# Altium project PTZ_CTRLER.PrjPcb
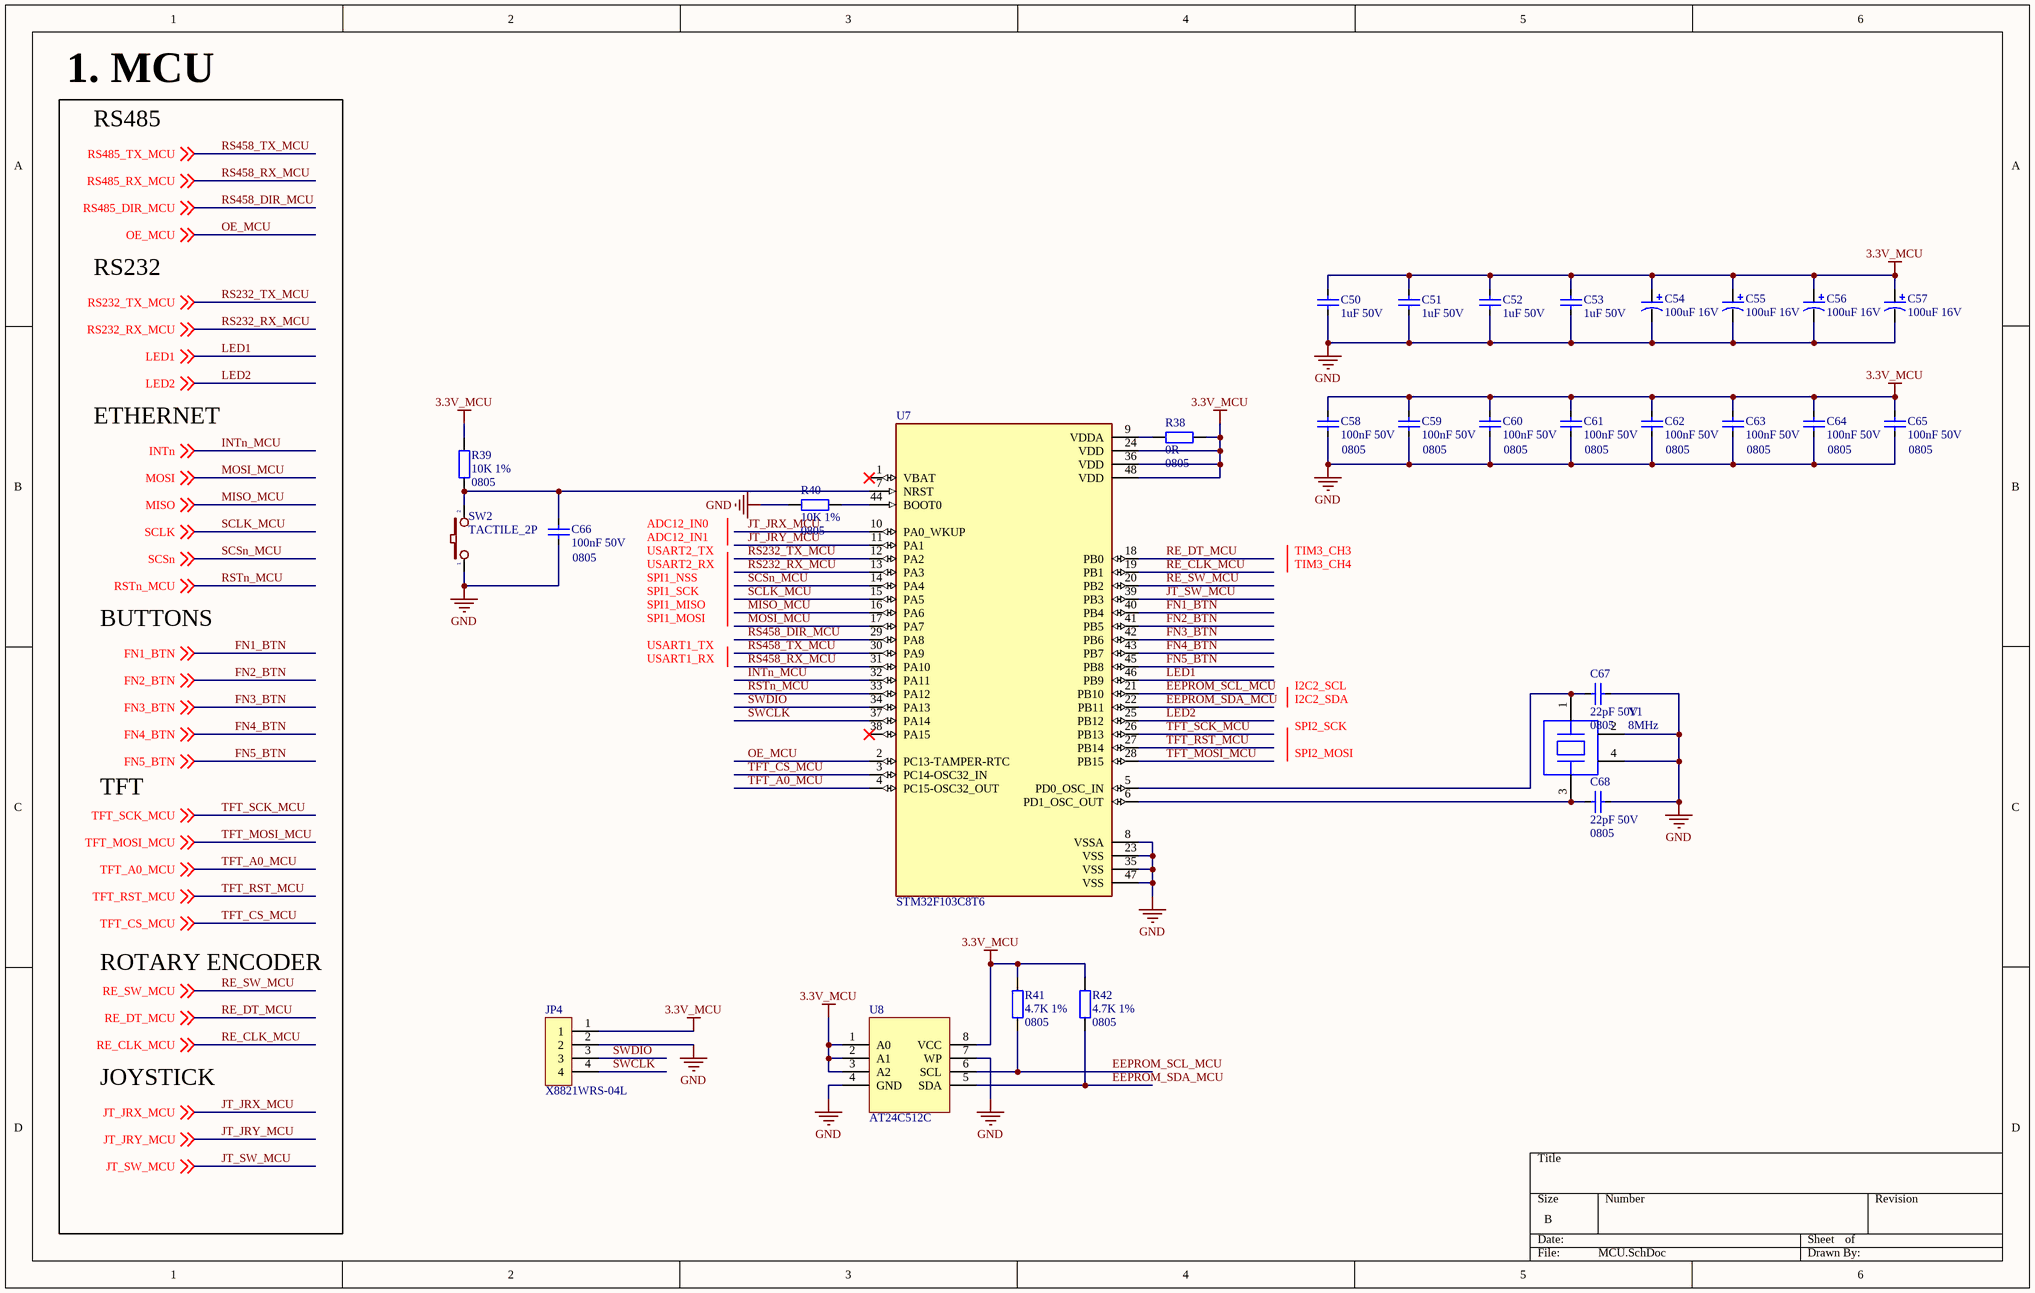
[diagram p0: MCU.SchDoc]
5 sheets, 138 parts. Net scope: global (net labels, ports and power ports of the same name join across sheets).
Sheets:
  MCU.SchDoc
  RS485_RS232.SchDoc
  ETHERNET.SchDoc
  SOURCE.SchDoc
  PERIPHERALS.SchDoc

## Sheet MCU.SchDoc
size B; SheetNumber: 1; SheetTotal: 5

### Parts
C50  1uF 50V  [CAP_SMD_0805]
C51  1uF 50V  [CAP_SMD_0805]
C52  1uF 50V  [CAP_SMD_0805]
C53  1uF 50V  [CAP_SMD_0805]
C54  100uF 16V  [CAP-ALU-SMD-D]
C55  100uF 16V  [CAP-ALU-SMD-D]
C56  100uF 16V  [CAP-ALU-SMD-D]
C57  100uF 16V  [CAP-ALU-SMD-D]
C58  100nF 50V  Size: 0805  [CAP_SMD_0805]
C59  100nF 50V  Size: 0805  [CAP_SMD_0805]
C60  100nF 50V  Size: 0805  [CAP_SMD_0805]
C61  100nF 50V  Size: 0805  [CAP_SMD_0805]
C62  100nF 50V  Size: 0805  [CAP_SMD_0805]
C63  100nF 50V  Size: 0805  [CAP_SMD_0805]
C64  100nF 50V  Size: 0805  [CAP_SMD_0805]
C65  100nF 50V  Size: 0805  [CAP_SMD_0805]
C66  100nF 50V  Size: 0805  [CAP_SMD_0805]
C67  22pF 50V  Size: 0805  [CAP_SMD_0805]
C68  22pF 50V  Size: 0805  [CAP_SMD_0805]
JP4  X8821WRS-04L  [CONN_X8821WRS-04L-LPSN]
R38  0R  Size: 0805  [RES_SMD_0805]
R39  10K 1%  Size: 0805  [RES_SMD_0805]
R40  10K 1%  Size: 0805  [RES_SMD_0805]
R41  4.7K 1%  Size: 0805  [RES_SMD_0805]
R42  4.7K 1%  Size: 0805  [RES_SMD_0805]
SW2  TACTILE_2P  [C&K BUTTON 2P]
U7  STM32F103C8T6  [LQFP-48]
U8  AT24C512C  [SOIC-8]
Y1  8MHz  [SMD-3225_4P]

### Nets
3.3V_MCU: C50.2 C51.2 C52.2 C53.2 C54.1 C55.1 C56.1 C57.1 C58.2 C59.2 C60.2 C61.2 C62.2 C63.2 C64.2 C65.2 JP4.1 R38.2 R39.2 R41.2 R42.2 U7.24(VDD) U7.36(VDD) U7.48(VDD) U8.1(A0) U8.2(A1) U8.3(A2) U8.8(VCC)
GND: C50.1 C51.1 C52.1 C53.1 C54.2 C55.2 C56.2 C57.2 C58.1 C59.1 C60.1 C61.1 C62.1 C63.1 C64.1 C65.1 C66.1 C67.1 C68.1 JP4.2 R40.1 SW2.1 U7.8(VSSA) U7.23(VSS) U7.35(VSS) U7.47(VSS) U8.4(GND) U8.7(WP) Y1.2 Y1.4
EEPROM_SCL_MCU: R41.1 U7.21(PB10) U8.6(SCL)
EEPROM_SDA_MCU: R42.1 U7.22(PB11) U8.5(SDA)
FN1_BTN: U7.40(PB4) ; off-sheet FN1_BTN
FN2_BTN: U7.41(PB5) ; off-sheet FN2_BTN
FN3_BTN: U7.42(PB6) ; off-sheet FN3_BTN
FN4_BTN: U7.43(PB7) ; off-sheet FN4_BTN
FN5_BTN: U7.45(PB8) ; off-sheet FN5_BTN
INTn_MCU: U7.32(PA11) ; off-sheet INTn  [also labelled INTn]
JT_JRX_MCU: U7.10(PA0_WKUP) ; off-sheet JT_JRX_MCU
JT_JRY_MCU: U7.11(PA1) ; off-sheet JT_JRY_MCU
JT_SW_MCU: U7.39(PB3) ; off-sheet JT_SW_MCU
LED1: U7.46(PB9) ; off-sheet LED1
LED2: U7.25(PB12) ; off-sheet LED2
MISO_MCU: U7.16(PA6) ; off-sheet MISO  [also labelled MISO]
MOSI_MCU: U7.17(PA7) ; off-sheet MOSI  [also labelled MOSI]
OE_MCU: U7.2(PC13-TAMPER-RTC) ; off-sheet OE_MCU
RE_CLK_MCU: U7.19(PB1) ; off-sheet RE_CLK_MCU
RE_DT_MCU: U7.18(PB0) ; off-sheet RE_DT_MCU
RE_SW_MCU: U7.20(PB2) ; off-sheet RE_SW_MCU
RS232_RX_MCU: U7.13(PA3) ; off-sheet RS232_RX_MCU
RS232_TX_MCU: U7.12(PA2) ; off-sheet RS232_TX_MCU
RS458_DIR_MCU: U7.29(PA8) ; off-sheet RS485_DIR_MCU  [also labelled RS485_DIR_MCU]
RS458_RX_MCU: U7.31(PA10) ; off-sheet RS485_RX_MCU  [also labelled RS485_RX_MCU]
RS458_TX_MCU: U7.30(PA9) ; off-sheet RS485_TX_MCU  [also labelled RS485_TX_MCU]
RSTn_MCU: U7.33(PA12) ; off-sheet RSTn_MCU
SCLK_MCU: U7.15(PA5) ; off-sheet SCLK  [also labelled SCLK]
SCSn_MCU: U7.14(PA4) ; off-sheet SCSn  [also labelled SCSn]
SWCLK: JP4.4 U7.37(PA14)
SWDIO: JP4.3 U7.34(PA13)
TFT_A0_MCU: U7.4(PC15-OSC32_OUT) ; off-sheet TFT_A0_MCU
TFT_CS_MCU: U7.3(PC14-OSC32_IN) ; off-sheet TFT_CS_MCU
TFT_MOSI_MCU: U7.28(PB15) ; off-sheet TFT_MOSI_MCU
TFT_RST_MCU: U7.27(PB14) ; off-sheet TFT_RST_MCU
TFT_SCK_MCU: U7.26(PB13) ; off-sheet TFT_SCK_MCU
NetC66_2: C66.2 R39.1 SW2.2 U7.7(NRST)
NetC67_2: C67.2 U7.5(PD0_OSC_IN) Y1.1
NetC68_2: C68.2 U7.6(PD1_OSC_OUT) Y1.3
NetR38_1: R38.1 U7.9(VDDA)
NetR40_2: R40.2 U7.44(BOOT0)

Not connected (* = marked no-connect by the designer): U7 1(VBAT)* 38(PA15)*

### Notes on the sheet
- 1. MCU
- RS485
- RS232
- ETHERNET
- USART2_TX
- USART2_RX
- ADC12_IN0
- ADC12_IN1
- TIM3_CH3
- TIM3_CH4
- BUTTONS
- SPI1_NSS
- SPI1_SCK
- SPI1_MISO
- SPI1_MOSI
- USART1_TX
- USART1_RX
- I2C2_SCL
- I2C2_SDA
- SPI2_SCK
- SPI2_MOSI
- TFT
- ROTARY ENCODER
- JOYSTICK

### Library data of the parts
C50-C53 = C0805_MLCC_1uF_50V: 1 µF ±10% 50V Ceramic Capacitor X7R 0805 (2012 Metric); Manufacturer: Samsung Electro-Mechanics; Manufacture Part Number: CL21B105KBFNNNG; Packaging: Cut Tape (CT); Link: https://www.digikey.cn/en/products/detail/samsung-electro-mechanics/CL21B105KBFNNNG/3894467; Price: $0.11; Size: 0805
C54-C57 = C_ALU_100uF_16V: 100uF 16V 63mA@120Hz ±20% SMD,D6.3xL5.4mm Aluminum Electrolytic Capacitors - SMD ROHS; Manufacturer: DMBJ; Manufacture Part Number: RVT1C101M0605 100UF 16V; Link: https://www.lcsc.com/product-detail/Aluminum-Electrolytic-Capacitors-SMD_DMBJ-RVT1C101M0605-100UF-16V_C970684.html; Price: $1.37
C58-C66 = C0805_MLCC_100nF_50V: 0.1 µF ±10% 50V Ceramic Capacitor X7R 0805 (2012 Metric); Manufacturer: YAGEO; Manufacture Part Number: CC0805KRX7R9BB104; Packaging: Cut Tape (CT); Link: https://www.digikey.cn/en/products/detail/yageo/CC0805KRX7R9BB104/302874; Price: $0.10
C67 C68 = C0805_MLCC_22pF_50V: 22 pF ±1% 250V Ceramic Capacitor C0G, NP0 0805 (2012 Metric); Manufacturer: KYOCERA AVX; Manufacture Part Number: 600F220FT250XT; Packaging: Cut Tape (CT); Link: https://www.digikey.cn/en/products/detail/kyocera-avx/600F220FT250XT/3905100; Price: $2.26
JP4 = X8821WRS-04L: 1x4P 4P XH 1 Tin 2.5mm 4 3A Brass Surface Mount，Right Angle SMD,P=2.5mm,Surface Mount，Right Angle Wire To Board Connector ROHS; Manufacturer: XKB Connection; Manufacture Part Number: X8821WRS-04-9TSN; Link: https://www.lcsc.com/product-detail/Wire-To-Board-Connector_XKB-Connection-X8821WRS-04-9TSN_C397434.html; Price: $ 0.1564
R38 = R0805_0R: 0 Ohms Jumper Chip Resistor 0805 (2012 Metric) Automotive AEC-Q200 Thick Film; Manufacturer: Vishay Dale; Manufacture Part Number: CRCW08050000Z0EA; Packaging: Cut Tape (CT); Link: https://www.digikey.cn/en/products/detail/vishay-dale/CRCW08050000Z0EA/1175125; Price: $0.10
R39 R40 = R0805_10K: 10 kOhms ±1% 0.125W, 1/8W Chip Resistor 0805 (2012 Metric) Moisture Resistant Thick Film; Manufacturer: YAGEO; Manufacture Part Number: RC0805FR-0710KL; Packaging: Cut Tape (CT); Price: $0.10; Link: https://www.digikey.cn/en/products/detail/yageo/RC0805FR-0710KL/727535
R41 R42 = R0805_4.7K: 4.7 kOhms ±1% 0.125W, 1/8W Chip Resistor 0805 (2012 Metric) Thick Film; Manufacturer: Vishay Dale; Manufacture Part Number: CRCW08054K70FKEAC; Packaging: Cut Tape (CT); Link: https://www.digikey.com/en/products/detail/vishay-dale/CRCW08054K70FKEAC/7928553; Price: $0.10
SW2 = SWITCH_TACTILE_2P: Tactile Switch SPST-NO Top Actuated Surface Mount; Manufacturer: C&K; Manufacture Part Number: PTS636 SM43 SMTR LFS; Packaging: Cut Tape (CT); Link: https://www.digikey.com/en/products/detail/c-k/PTS636-SM43-SMTR-LFS/10071723; Price: $0.19
U7 = STM32F103C8T6: ARM® Cortex®-M3 STM32F1 Microcontroller IC 32-Bit Single-Core 72MHz 64KB (64K x 8) FLASH; Manufacturer: STMicroelectronics; Manufacture Part Number: STM32F103C8T6; Packaging: Tray; Link: https://www.digikey.cn/en/products/detail/stmicroelectronics/STM32F103C8T6/1646338; Price: $6.11
U8 = EEPROM_512K_AT24C512C: 512Kbit I2C SOIC-8 EEPROM ROHS; Manufacturer: Microchip Tech; Manufacture Part Number: AT24C512C-SSHD-T; Packaging: Cut Tape; Link: https://www.lcsc.com/product-detail/EEPROM_Microchip-Tech-AT24C512C-SSHD-T_C12371.html; Price: $ 0.58
Y1 = C3225_8MHz: 8MHz 贴片晶振 12pF ±10ppm ±20ppm SMD3225-4P Crystals ROHS; Manufacturer: YXC Crystal Oscillators; Manufacture Part Number: X32258MOB4SI; Packaging: Cut Tape; ComponentLink1Description: New link; ComponentLink1URL: *; Link: https://www.lcsc.com/product-detail/Crystals_YXC-span-style-background-color-ff0-Crystal-span-Oscillators-X32258MOB4SI_C2682775.html; Price: $ 0.1426

## Sheet RS485_RS232.SchDoc
size A4; SheetNumber: 2; SheetTotal: 5
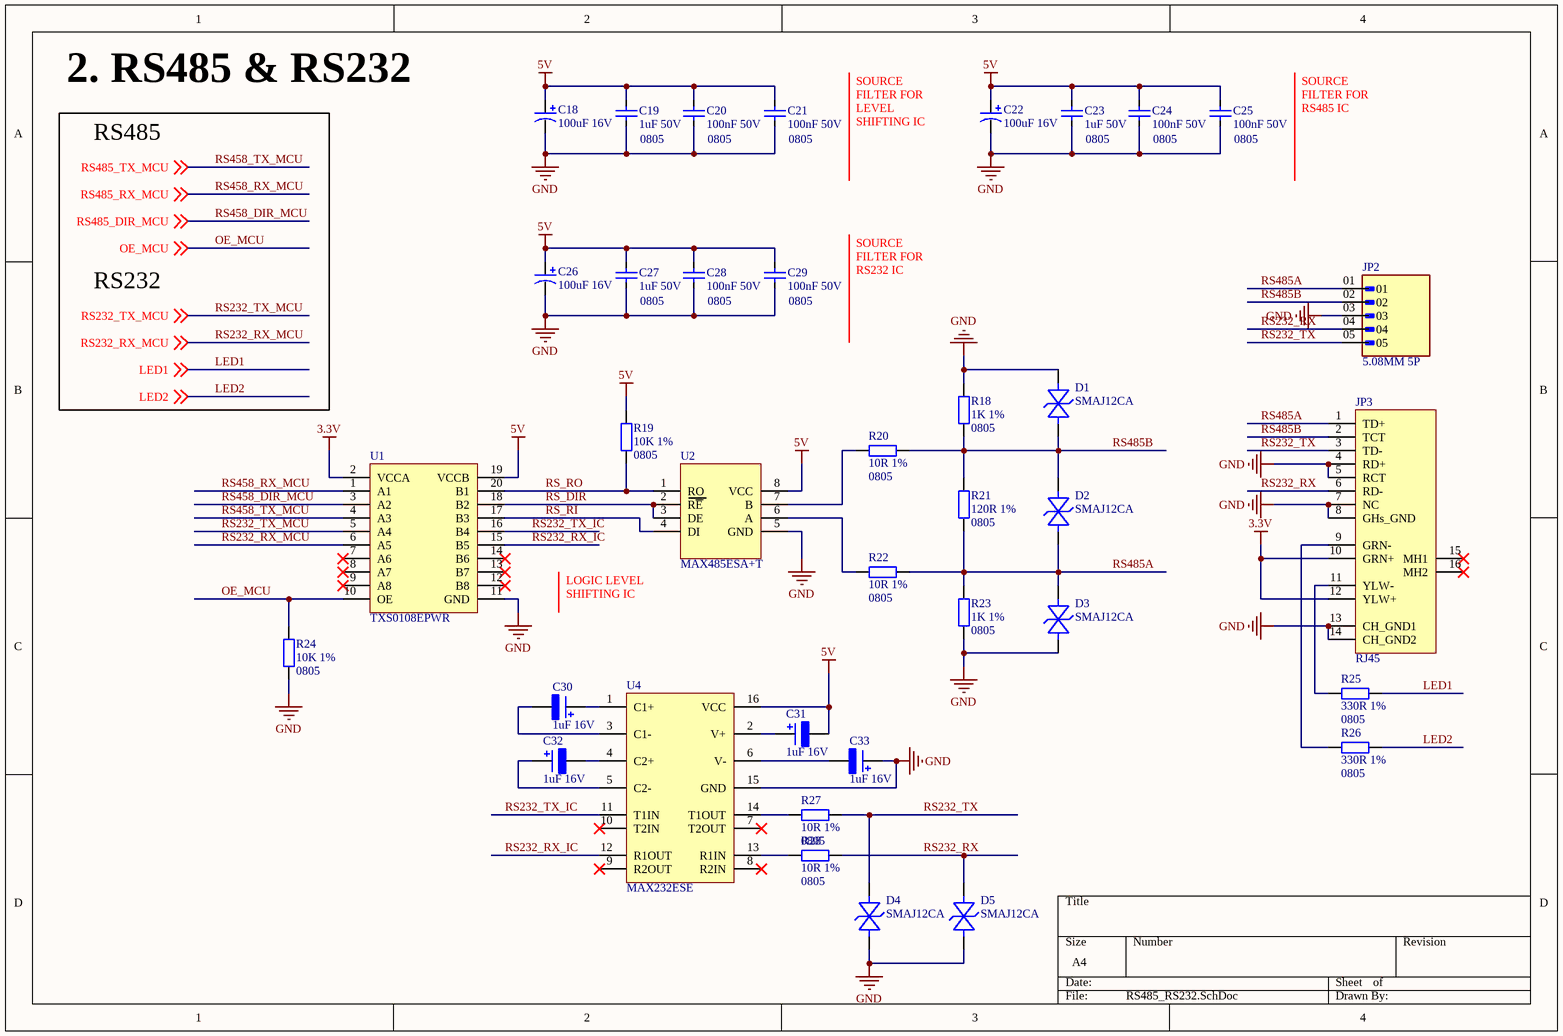
[diagram p1: RS485_RS232.SchDoc]

### Parts
C18  100uF 16V  [CAP-ALU-SMD-D]
C19  1uF 50V  Size: 0805  [CAP_SMD_0805]
C20  100nF 50V  Size: 0805  [CAP_SMD_0805]
C21  100nF 50V  Size: 0805  [CAP_SMD_0805]
C22  100uF 16V  [CAP-ALU-SMD-D]
C23  1uF 50V  Size: 0805  [CAP_SMD_0805]
C24  100nF 50V  Size: 0805  [CAP_SMD_0805]
C25  100nF 50V  Size: 0805  [CAP_SMD_0805]
C26  100uF 16V  [CAP-ALU-SMD-D]
C27  1uF 50V  Size: 0805  [CAP_SMD_0805]
C28  100nF 50V  Size: 0805  [CAP_SMD_0805]
C29  100nF 50V  Size: 0805  [CAP_SMD_0805]
C30  1uF 16V  [TANTALUM_3216]
C31  1uF 16V  [TANTALUM_3216]
C32  1uF 16V  [TANTALUM_3216]
C33  1uF 16V  [TANTALUM_3216]
D1  SMAJ12CA  [SMA]
D2  SMAJ12CA  [SMA]
D3  SMAJ12CA  [SMA]
D4  SMAJ12CA  [SMA]
D5  SMAJ12CA  [SMA]
JP2  5.08MM 5P  [5.08MM 5P]
JP3  RJ45  [RJ 45]
R18  1K 1%  Size: 0805  [RES_SMD_0805]
R19  10K 1%  Size: 0805  [RES_SMD_0805]
R20  10R 1%  Size: 0805  [RES_SMD_0805]
R21  120R 1%  Size: 0805  [RES_SMD_0805]
R22  10R 1%  Size: 0805  [RES_SMD_0805]
R23  1K 1%  Size: 0805  [RES_SMD_0805]
R24  10K 1%  Size: 0805  [RES_SMD_0805]
R25  330R 1%  Size: 0805  [RES_SMD_0805]
R26  330R 1%  Size: 0805  [RES_SMD_0805]
R27  10R 1%  Size: 0805  [RES_SMD_0805]
R28  10R 1%  Size: 0805  [RES_SMD_0805]
U1  TXS0108EPWR  [20-TSSOP]
U2  MAX485ESA+T  [SOIC-8]
U4  MAX232ESE  [SOP-16]

### Nets
3.3V: JP3.10(GRN+) JP3.12(YLW+) U1.2(VCCA)
5V: C18.1 C19.1 C20.2 C21.2 C22.1 C23.1 C24.2 C25.2 C26.1 C27.1 C28.2 C29.2 C31.2 R19.2 U1.19(VCCB) U2.8(VCC) U4.16(VCC)
GND: C18.2 C19.2 C20.1 C21.1 C22.2 C23.2 C24.1 C25.1 C26.2 C27.2 C28.1 C29.1 C33.1 D1.A D3.C D4.C D5.C JP2.03 JP3.4(RD+) JP3.5(RCT) JP3.7(NC) JP3.8(GHs_GND) JP3.13(CH_GND1) JP3.14(CH_GND2) R18.2 R23.1 R24.1 U1.11(GND) U2.5(GND) U4.15(GND)
LED1: R25.2 ; off-sheet LED1
LED2: R26.2 ; off-sheet LED2
OE_MCU: R24.2 U1.10(OE) ; off-sheet OE_MCU
RS232_RX: D5.A JP2.04 JP3.6(RD-) R28.2
RS232_RX_IC: U1.15(B5) U4.12(R1OUT)
RS232_RX_MCU: U1.6(A5) ; off-sheet RS232_RX_MCU
RS232_TX: D4.A JP2.05 JP3.3(TD-) R27.2
RS232_TX_IC: U1.16(B4) U4.11(T1IN)
RS232_TX_MCU: U1.5(A4) ; off-sheet RS232_TX_MCU
RS458_DIR_MCU: U1.3(A2) ; off-sheet RS485_DIR_MCU  [also labelled RS485_DIR_MCU]
RS458_RX_MCU: U1.1(A1) ; off-sheet RS485_RX_MCU  [also labelled RS485_RX_MCU]
RS458_TX_MCU: U1.4(A3) ; off-sheet RS485_TX_MCU  [also labelled RS485_TX_MCU]
RS485A: D2.C D3.A JP2.01 JP3.1(TD+) R21.1 R22.2 R23.2
RS485B: D1.C D2.A JP2.02 JP3.2(TCT) R18.1 R20.2 R21.2
RS_DIR: U1.18(B2) U2.2(R~{E}) U2.3(DE)
RS_RI: U1.17(B3) U2.4(DI)
RS_RO: R19.1 U1.20(B1) U2.1(RO)
NetC30_1: C30.1 U4.1(C1+)
NetC30_2: C30.2 U4.3(C1-)
NetC31_1: C31.1 U4.2(V+)
NetC32_1: C32.1 U4.5(C2-)
NetC32_2: C32.2 U4.4(C2+)
NetC33_2: C33.2 U4.6(V-)
NetJP3_9: JP3.9(GRN-) R26.1
NetJP3_11: JP3.11(YLW-) R25.1
NetR20_1: R20.1 U2.7(B)
NetR22_1: R22.1 U2.6(A)
NetR27_1: R27.1 U4.14(T1OUT)
NetR28_1: R28.1 U4.13(R1IN)

Not connected (* = marked no-connect by the designer): JP3 15(MH1)* 16(MH2)*; U1 7(A6)* 8(A7)* 9(A8)* 12(B8)* 13(B7)* 14(B6)*; U4 7(T2OUT)* 8(R2IN)* 9(R2OUT)* 10(T2IN)*

### Notes on the sheet
- 2. RS485 & RS232
- RS485
- SOURCE FILTER FOR LEVEL SHIFTING IC
- SOURCE FILTER FOR RS485 IC
- RS232
- SOURCE FILTER FOR RS232 IC
- (near U2) LOGIC LEVEL SHIFTING IC

### Library data of the parts
C18 C22 C26 = C_ALU_100uF_16V: as C54 on sheet MCU; Link: https://www.lcsc.com/product-detail/Aluminum-Electrolytic-Capacitors-SMD_DMBJ-RVT1C101M0605-100UF-16V_C970684.html; Price: $1.37
C19 C23 C27 = C0805_MLCC_1uF_50V: as C50 on sheet MCU; Packaging: Cut Tape (CT); Link: https://www.digikey.cn/en/products/detail/samsung-electro-mechanics/CL21B105KBFNNNG/3894467; Price: $0.11
C20 C21 C24 C25 C28 C29 = C0805_MLCC_100nF_50V: as C58 on sheet MCU; Packaging: Cut Tape (CT); Link: https://www.digikey.cn/en/products/detail/yageo/CC0805KRX7R9BB104/302874; Price: $0.10
C30-C33 = C3216_TAN_1uF_16V: 10 µF Molded Tantalum Capacitors 16 V 1210 (3528 Metric) 2.8Ohm; Manufacturer: KEMET; Manufacture Part Number: T491A105K016AT; Capacitance: 1 µF; Tolerance: ±10%; Packaging: Cut Tape; Link: https://www.digikey.cn/en/products/detail/kemet/T491A105K016AT/818539; Price: $0.45; Voltage - Rated: 16 V; Operating Temperature: -55°C ~ 125°C
D1-D5 = TVS_20V_SMAJ12CA: 19.9V Clamp 20.1A Ipp Tvs Diode Surface Mount DO-214AC (SMA); Manufacturer: Littelfuse Inc.; Voltage - Reverse Standoff (Typ): 12V; Voltage - Breakdown (Min): 13.3V; Manufacture Part Number: SMAJ12CA; Packaging: Cut Tape (CT); Link: https://www.digikey.cn/en/products/detail/littelfuse-inc/SMAJ12CA/762271; Price: SMAJ12CA; Voltage - Clamping (Max) @ Ipp: 19.9V
JP2 = TERMINAL_5.08MM_5P: 5 Position Terminal Block Header, Male Pins, Shrouded (2 Side) 0.200" (5.08mm) 90°, Right Angle Through Hole; Manufacturer: Phoenix Contact; Manufacture Part Number: 1759046; Packaging: Bulk; Link: https://www.digikey.cn/en/products/detail/phoenix-contact/1759046/260466; Price: $1.61
JP3 = RJ45: 1 Port RJ45Through Hole 10/100 Base-T, AutoMDIX; Manufacturer: WIZnet; Manufacture Part Number: 1278-1052-ND; Packaging: Bulk; Link: https://www.digikey.com/en/products/detail/wiznet/j1b1211ccd/7604176; Price: $3.83
R18 R23 = R0805_1K: 1 kOhms ±1% 0.125W, 1/8W Chip Resistor 0805 (2012 Metric) Moisture Resistant Thick Film; Manufacturer: YAGEO; Manufacture Part Number: 311-1.00KCRCT-ND; Packaging: Cut Tape (CT); Link: https://www.digikey.com/en/products/detail/yageo/RC0805FR-071KL/727444; Price: $0.10
R19 R24 = R0805_10K: as R39 on sheet MCU; Packaging: Cut Tape (CT); Price: $0.10; Link: https://www.digikey.cn/en/products/detail/yageo/RC0805FR-0710KL/727535
R20 R22 R27 R28 = R0805_10R: 10 Ohms ±1% 0.125W, 1/8W Chip Resistor 0805 (2012 Metric) Moisture Resistant Thick Film; Manufacturer: YAGEO; Manufacture Part Number: RC0805FR-0710RL; Packaging: Cut Tape (CT); Link: https://www.digikey.com/en/products/detail/yageo/RC0805FR-0710RL/727534; Price: $0.10
R21 = R0805_120R: 120 Ohms ±1% 0.125W, 1/8W Chip Resistor 0805 (2012 Metric) Automotive AEC-Q200 Thick Film; Manufacturer: Stackpole Electronics Inc; Manufacture Part Number: RMCF0805FT120R; Packaging: Cut Tape (CT); Link: https://www.digikey.cn/en/products/detail/stackpole-electronics-inc/RMCF0805FT120R/1712658; Price: $0.10
R25 R26 = R0805_330R: 330 Ohms ±1% 0.125W, 1/8W Chip Resistor 0805 (2012 Metric) Automotive AEC-Q200 Thick Film; Manufacturer: Stackpole Electronics Inc; Manufacture Part Number: RMCF0805FT330R; Packaging: Cut Tape (CT); Link: https://www.digikey.cn/en/products/detail/stackpole-electronics-inc/RMCF0805FT330R/1760484; Price: $0.10
U1 = TXS0108EPWR: Voltage Level Translator Bidirectional 1 Circuit 8 Channel 60Mbps 20-TSSOP; Manufacturer: Texas Instruments; Manufacture Part Number: TXS0108EPWR; Packaging: Cut Tape; Link: https://www.digikey.cn/en/products/detail/texas-instruments/TXS0108EPWR/1775302; Price: $1.60
U2 = MAX485ESA+T: RS-422/RS-485 Interface IC Low-Power, Slew-Rate-Limited RS-485/RS-4; Manufacturer: Analog Devices / Maxim Integrated; Manufacture Part Number: MAX485ESA+T; Link: https://www.mouser.vn/ProductDetail/Analog-Devices-Maxim-Integrated/MAX485ESA%2bT?qs=LHmEVA8xxfYXmvxEk%252BFtEg%3D%3D; Price: $4.66
U4 = MAX232ESE: 2/2 Transceiver Full RS232 16-SOP; Manufacturer: UMW; Manufacture Part Number: MAX232ESE; Packaging: Cut Tape; Link: https://www.digikey.cn/en/products/detail/umw/max232ese/16705942; Price: $3.00

## Sheet ETHERNET.SchDoc
size B; SheetNumber: 3; SheetTotal: 5
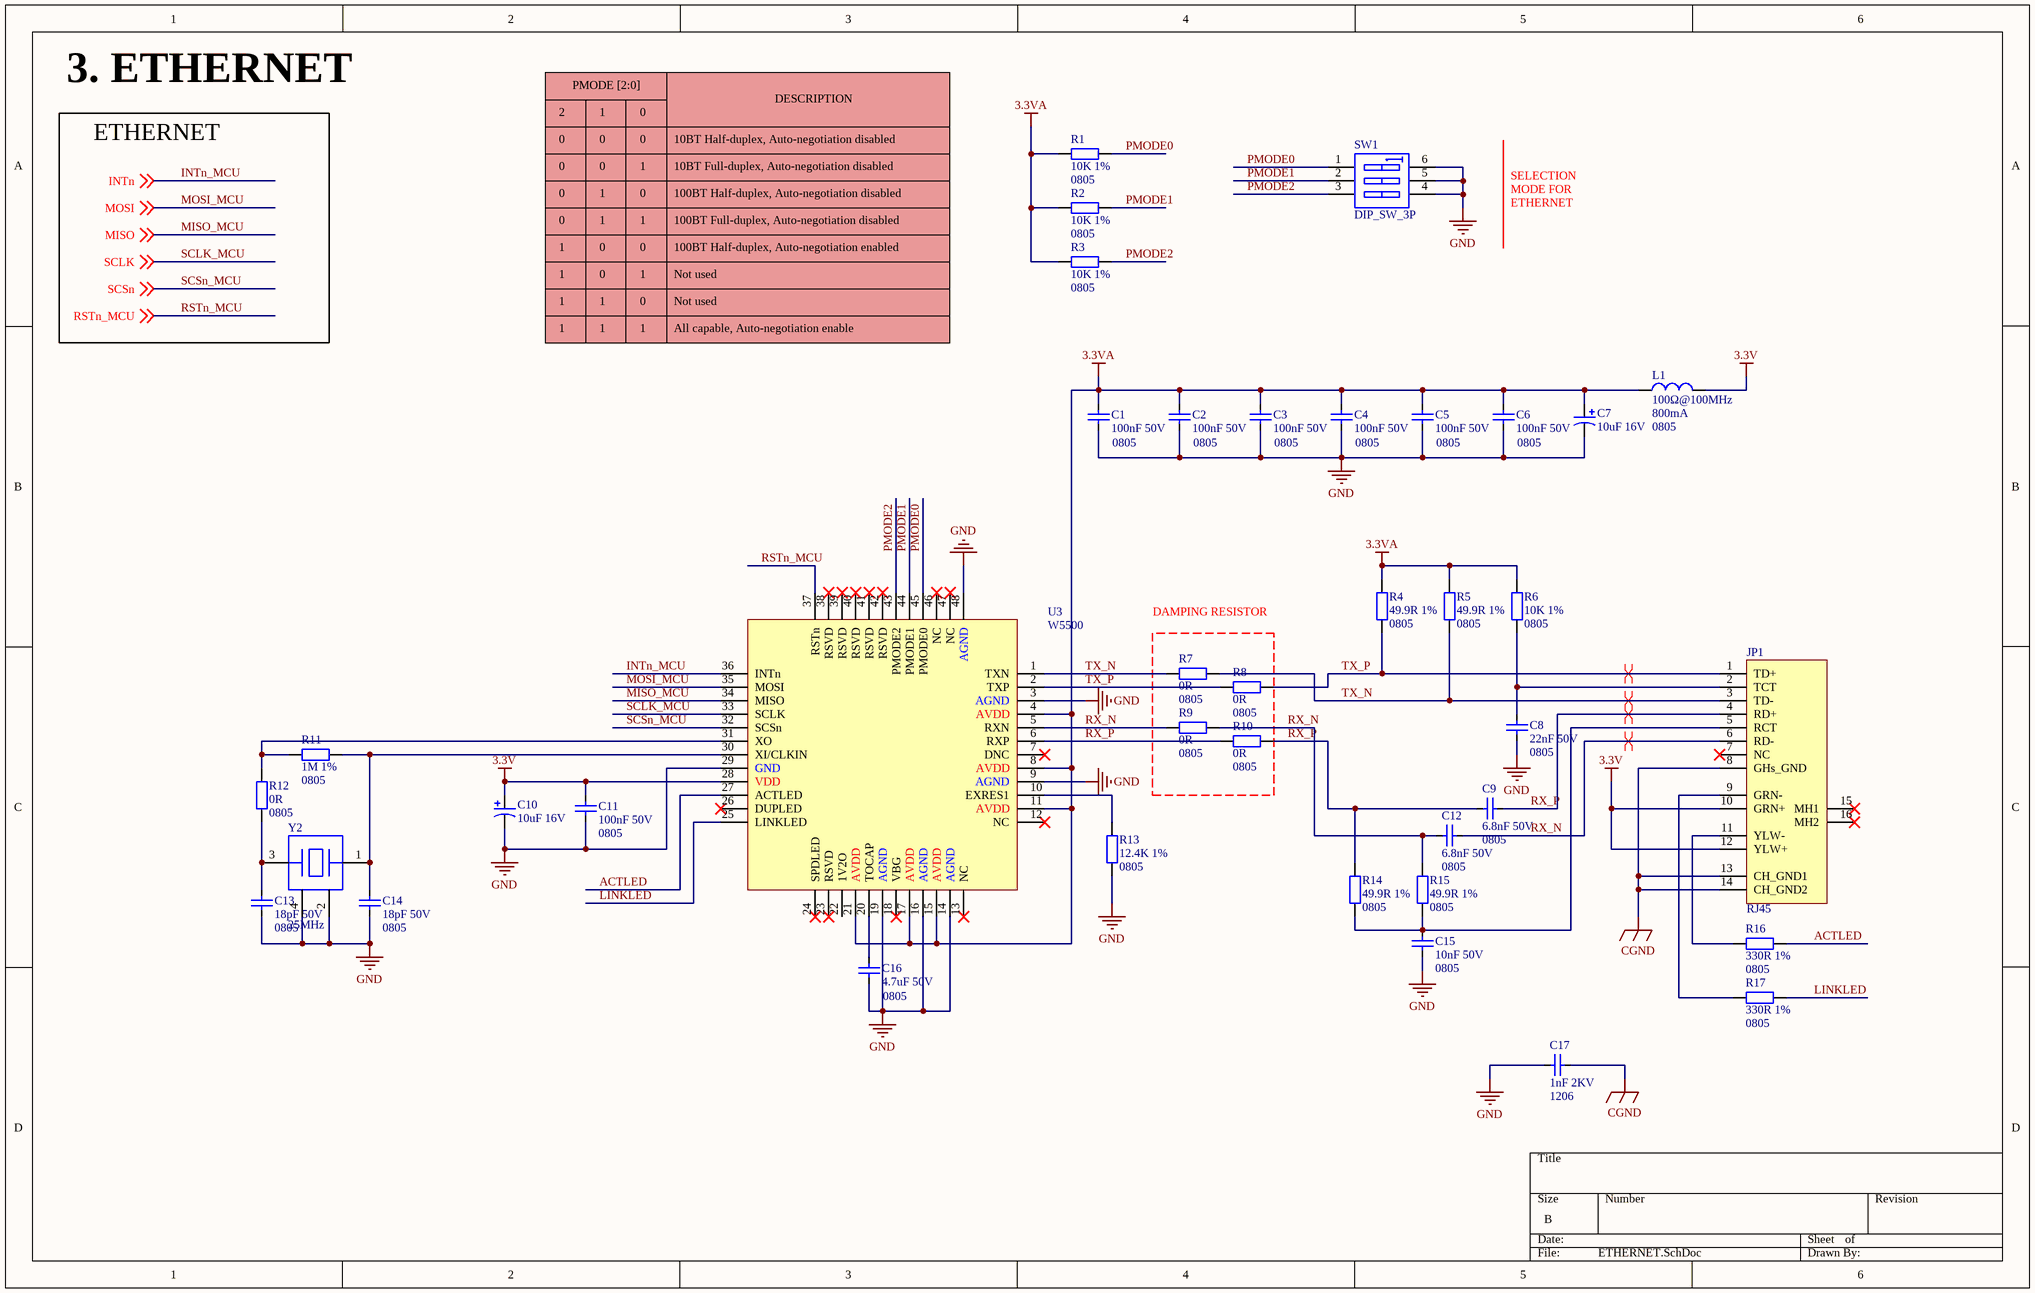
[diagram p2: ETHERNET.SchDoc]

### Parts
C1  100nF 50V  Size: 0805  [CAP_SMD_0805]
C2  100nF 50V  Size: 0805  [CAP_SMD_0805]
C3  100nF 50V  Size: 0805  [CAP_SMD_0805]
C4  100nF 50V  Size: 0805  [CAP_SMD_0805]
C5  100nF 50V  Size: 0805  [CAP_SMD_0805]
C6  100nF 50V  Size: 0805  [CAP_SMD_0805]
C7  10uF 16V  [CAP-ALU-SMD-C]
C8  22nF 50V  Size: 0805  [CAP_SMD_0805]
C9  6.8nF 50V  Size: 0805  [CAP_SMD_0805]
C10  10uF 16V  [CAP-ALU-SMD-C]
C11  100nF 50V  Size: 0805  [CAP_SMD_0805]
C12  6.8nF 50V  Size: 0805  [CAP_SMD_0805]
C13  18pF 50V  Size: 0805  [CAP_SMD_0805]
C14  18pF 50V  Size: 0805  [CAP_SMD_0805]
C15  10nF 50V  Size: 0805  [CAP_SMD_0805]
C16  4.7uF 50V  Size: 0805  [CAP_SMD_0805]
C17  1nF 2KV  Size: 1206  [CAP_SMD_0805]
JP1  RJ45  [RJ 45]
L1  Impedance @ Frequency: 100Ω@100MHz  Current: 800mA  Size: 0805  [FB_0805]  (hidden comment: 100Ohms 100Mhz)
R1  10K 1%  Size: 0805  [RES_SMD_0805]
R2  10K 1%  Size: 0805  [RES_SMD_0805]
R3  10K 1%  Size: 0805  [RES_SMD_0805]
R4  49.9R 1%  Size: 0805  [RES_SMD_0805]
R5  49.9R 1%  Size: 0805  [RES_SMD_0805]
R6  10K 1%  Size: 0805  [RES_SMD_0805]
R7  0R  Size: 0805  [RES_SMD_0805]
R8  0R  Size: 0805  [RES_SMD_0805]
R9  0R  Size: 0805  [RES_SMD_0805]
R10  0R  Size: 0805  [RES_SMD_0805]
R11  1M 1%  Size: 0805  [RES_SMD_0805]
R12  0R  Size: 0805  [RES_SMD_0805]
R13  12.4K 1%  Size: 0805  [RES_SMD_0805]
R14  49.9R 1%  Size: 0805  [RES_SMD_0805]
R15  49.9R 1%  Size: 0805  [RES_SMD_0805]
R16  330R 1%  Size: 0805  [RES_SMD_0805]
R17  330R 1%  Size: 0805  [RES_SMD_0805]
SW1  DIP_SW_3P  [DIPSWITCH3]
U3  W5500  [LQFP 48]
Y2  25MHz  [SMD-3225_4P]

### Blocks framed on the sheet
DAMPING RESISTOR: R7-R10

### Nets
3.3V: C10.1 C11.2 JP1.10(GRN+) JP1.12(YLW+) L1.2 U3.28(VDD)
3.3VA: C1.2 C2.2 C3.2 C4.2 C5.2 C6.2 C7.1 L1.1 R1.2 R2.2 R3.2 R4.2 R5.2 R6.2 U3.4(AVDD) U3.8(AVDD) U3.11(AVDD) U3.15(AVDD) U3.17(AVDD) U3.21(AVDD)
CGND: C17.2 JP1.8(GHs_GND) JP1.13(CH_GND1) JP1.14(CH_GND2)
GND: C1.1 C2.1 C3.1 C4.1 C5.1 C6.1 C7.2 C8.1 C10.2 C11.1 C13.1 C14.1 C15.1 C16.1 C17.1 R13.1 SW1.4(B3) SW1.5(B2) SW1.6(B1) U3.3(AGND) U3.9(AGND) U3.14(AGND) U3.16(AGND) U3.19(AGND) U3.29(GND) U3.48(AGND) Y2.2 Y2.4
ACTLED: R16.2 U3.27(ACTLED)
INTn_MCU: U3.36(INTn) ; off-sheet INTn  [also labelled INTn]
LINKLED: R17.2 U3.25(LINKLED)
MISO_MCU: U3.34(MISO) ; off-sheet MISO  [also labelled MISO]
MOSI_MCU: U3.35(MOSI) ; off-sheet MOSI  [also labelled MOSI]
PMODE0: R1.1 SW1.1(A1) U3.45(PMODE0)
PMODE1: R2.1 SW1.2(A2) U3.44(PMODE1)
PMODE2: R3.1 SW1.3(A3) U3.43(PMODE2)
RSTn_MCU: U3.37(RSTn) ; off-sheet RSTn_MCU
RX_N: C12.1 C12.2 JP1.6(RD-) R9.1 R9.2 R15.2 U3.5(RXN)
RX_P: C9.1 C9.2 JP1.4(RD+) R10.1 R10.2 R14.2 U3.6(RXP)
SCLK_MCU: U3.33(SCLK) ; off-sheet SCLK  [also labelled SCLK]
SCSn_MCU: U3.32(SCSn) ; off-sheet SCSn  [also labelled SCSn]
TX_N: JP1.3(TD-) R5.1 R7.1 R7.2 U3.1(TXN)
TX_P: JP1.1(TD+) R4.1 R8.1 R8.2 U3.2(TXP)
NetC8_2: C8.2 JP1.2(TCT) R6.1
NetC13_2: C13.2 R12.1 Y2.3
NetC14_2: C14.2 R11.2 U3.30(XI/CLKIN) Y2.1
NetC15_2: C15.2 JP1.5(RCT) R14.1 R15.1
NetC16_2: C16.2 U3.20(TOCAP)
NetJP1_9: JP1.9(GRN-) R17.1
NetJP1_11: JP1.11(YLW-) R16.1
NetR11_1: R11.1 R12.2 U3.31(XO)
NetR13_2: R13.2 U3.10(EXRES1)

Not connected (* = marked no-connect by the designer): JP1 7(NC)* 15(MH1)* 16(MH2)*; U3 7(DNC)* 12(NC)* 13(NC)* 18(VBG)* 22(1V2O) 23(RSVD)* 24(SPDLED)* 26(DUPLED)* 38(RSVD)* 39(RSVD)* 40(RSVD)* 41(RSVD)* 42(RSVD)* 46(NC)* 47(NC)*

### Layout directives
differential pair: RX_N, RX_P, TX_N, TX_P

### Notes on the sheet
- 3. ETHERNET
- PMODE [2:0]
- DESCRIPTION
- ETHERNET
- 2
- 0
- 1
- 10BT Half-duplex, Auto-negotiation disabled
- 10BT Full-duplex, Auto-negotiation disabled
- 100BT Half-duplex, Auto-negotiation disabled
- 100BT Full-duplex, Auto-negotiation disabled
- SELECTION MODE FOR ETHERNET
- 100BT Half-duplex, Auto-negotiation enabled
- Not used
- All capable, Auto-negotiation enable

### Library data of the parts
C1-C6 C11 = C0805_MLCC_100nF_50V: as C58 on sheet MCU; Packaging: Cut Tape (CT); Link: https://www.digikey.cn/en/products/detail/yageo/CC0805KRX7R9BB104/302874; Price: $0.10
C7 C10 = C_ALU_10uF_16V: 10 µF 16 V Aluminum - Polymer Capacitors Radial, Can - SMD 30mOhm 2000 Hrs @ 105°C; Manufacturer: Würth Elektronik; Manufacture Part Number: 875105359001; Packaging: Cut Tape (CT); Link: https://www.digikey.cn/en/products/detail/w%C3%BCrth-elektronik/875105359001/5147580; Price: $0.51; Size: C
C8 = C0805_MLCC_22nF_50V: 0.022 µF ±5% 50V Ceramic Capacitor C0G, NP0 0805 (2012 Metric); Manufacturer: TDK Corporation; Manufacture Part Number: CGA4J2C0G1H223J125AA; Packaging: Cut Tape (CT); Link: https://www.digikey.cn/en/products/detail/tdk-corporation/CGA4J2C0G1H223J125AA/2672842; Price: $0.30
C9 C12 = C0805_MLCC_6.8nF_50V: 6800 pF ±10% 50V Ceramic Capacitor X7R 0805 (2012 Metric); Manufacturer: KEMET; Manufacture Part Number: C0805C682K5RAC7800; Packaging: Cut Tape (CT); Link: https://www.digikey.cn/en/products/detail/kemet/C0805C682K5RAC7800/411156; Price: $0.10
C13 C14 = C0805_MLCC_18pF_50V: Multilayer Ceramic Capacitors MLCC - SMD/SMT 50V 18pF C0G 0805 1%; Manufacturer: KEMET; Manufacture Part Number: C0805C180F5GACTU; Packaging: Cut Tape (CT); Link: https://www.mouser.vn/ProductDetail/KEMET/C0805C180F5GACTU?qs=sGAEpiMZZMsh%252B1woXyUXj2jXeRYF1Ky29I58L2KXMTM%3D; Price: $0.68
C15 = C0805_MLCC_10nF_50V: 10000 pF ±10% 50V Ceramic Capacitor X7R 0805 (2012 Metric); Manufacturer: Samsung Electro-Mechanics; Manufacture Part Number: CL21B103KBANNNC; Packaging: Cut Tape (CT); Link: https://www.digikey.cn/en/products/detail/samsung-electro-mechanics/CL21B103KBANNNC/3886673; Price: $0.10
C16 = C0805_MLCC_4.7uF_50V: 4.7 µF ±10% 50V Ceramic Capacitor X5R 0805 (2012 Metric); Manufacturer: Samsung Electro-Mechanics; Manufacture Part Number: CL21A475KBQNNNE; Packaging: Cut Tape (CT); Link: https://www.digikey.cn/en/products/detail/samsung-electro-mechanics/CL21A475KBQNNNE/3886906; Price: $0.23
C17 = C1206_MLCC_1nF_2KV: 1000 pF ±5% 2000V (2kV) Ceramic Capacitor X7R 1206 (3216 Metric); Manufacturer: YAGEO; Manufacture Part Number: CC1206JKX7RDBB102; Packaging: Cut Tape (CT); Link: https://www.digikey.cn/en/products/detail/yageo/CC1206JKX7RDBB102/5884438; Price: $0.28
JP1 = RJ45: as JP3 on sheet RS485_RS232; Packaging: Bulk; Link: https://www.digikey.com/en/products/detail/wiznet/j1b1211ccd/7604176; Price: $3.83
L1 = FR_100Ohms_100Mhz: Manufacturer: TAI-TECH; Manufacture Part Number: FCM2012KF-101T08; Link: https://jlcpcb.com/partdetail/taitech-FCM2012KF101T08/C304250; Price: $0.0064
R1-R3 R6 = R0805_10K: as R39 on sheet MCU; Packaging: Cut Tape (CT); Price: $0.10; Link: https://www.digikey.cn/en/products/detail/yageo/RC0805FR-0710KL/727535
R4 R5 R14 R15 = R0805_49.9R: 49.9 Ohms ±1% 0.125W, 1/8W Chip Resistor 0805 (2012 Metric) Automotive AEC-Q200 Thick Film; Manufacturer: Stackpole Electronics Inc; Manufacture Part Number: RMCF0805FT49R9; Packaging: Cut Tape (CT); Link: https://www.digikey.com/en/products/detail/stackpole-electronics-inc/RMCF0805FT49R9/1760281; Price: $0.10
R7-R10 R12 = R0805_0R: as R38 on sheet MCU; Packaging: Cut Tape (CT); Link: https://www.digikey.cn/en/products/detail/vishay-dale/CRCW08050000Z0EA/1175125; Price: $0.10
R11 = R0805_1M: 1 MOhms ±1% 0.125W, 1/8W Chip Resistor 0805 (2012 Metric) Automotive AEC-Q200 Thick Film; Manufacturer: Stackpole Electronics Inc; Manufacture Part Number: RMCF0805FT1M00; Packaging: Cut Tape (CT); Link: https://www.digikey.com/en/products/detail/stackpole-electronics-inc/RMCF0805FT1M00/1760080; Price: $0.10
R13 = R0805_12.4K: 12.4 kOhms ±1% 0.125W, 1/8W Chip Resistor 0805 (2012 Metric) Automotive AEC-Q200 Thick Film; Manufacturer: Stackpole Electronics Inc; Manufacture Part Number: RMCF0805FT12K4; Packaging: Cut Tape (CT); Link: https://www.digikey.com/en/products/detail/stackpole-electronics-inc/RMCF0805FT12K4/1760664; Price: $0.10
R16 R17 = R0805_330R: as R25 on sheet RS485_RS232; Packaging: Cut Tape (CT); Link: https://www.digikey.cn/en/products/detail/stackpole-electronics-inc/RMCF0805FT330R/1760484; Price: $0.10
SW1 = DIP_SW_3P: Dip Switch SPST 3 Position Through Hole Slide (Standard) Actuator 25mA 24VDC; Manufacturer: CIT Relay and Switch; Manufacture Part Number: KG03E; Packaging: Tube; Link: https://www.digikey.cn/en/products/detail/cit-relay-and-switch/KG03E/15294176; Price: $0.65
U3 = W5500: Ethernet ICs 3in1 Enet Controller TCP/IP +MAC+PHY; Manufacturer: WIZnet; Manufacture Part Number: W5500; Packaging: Cut Tape; Link: https://www.mouser.vn/ProductDetail/WIZnet/W5500?qs=2vh%252B45pPFtzthUpYPd4pqA%3D%3D; Price: $3.67
Y2 = C3225_25MHz: 3.3V HCMOS ±4.6ppm 25MHz SMD3225-4P Temperature Compensated Crystal Oscillators (TCXOs) ROHS; Manufacturer: HCI; Manufacture Part Number: TC32H4-25.000-33GNDTNL; Packaging: Cut Tape; ComponentLink1Description: New link; ComponentLink1URL: *; Link: https://www.lcsc.com/product-detail/Temperature-Compensated-span-style-background-color-ff0-Crystal-span-Oscillators-TCXOs_HCI-TC32H4-25-000-33GNDTNL_C5119013.html; Price: $ 3.52

## Sheet SOURCE.SchDoc
size A4; SheetNumber: 4; SheetTotal: 5
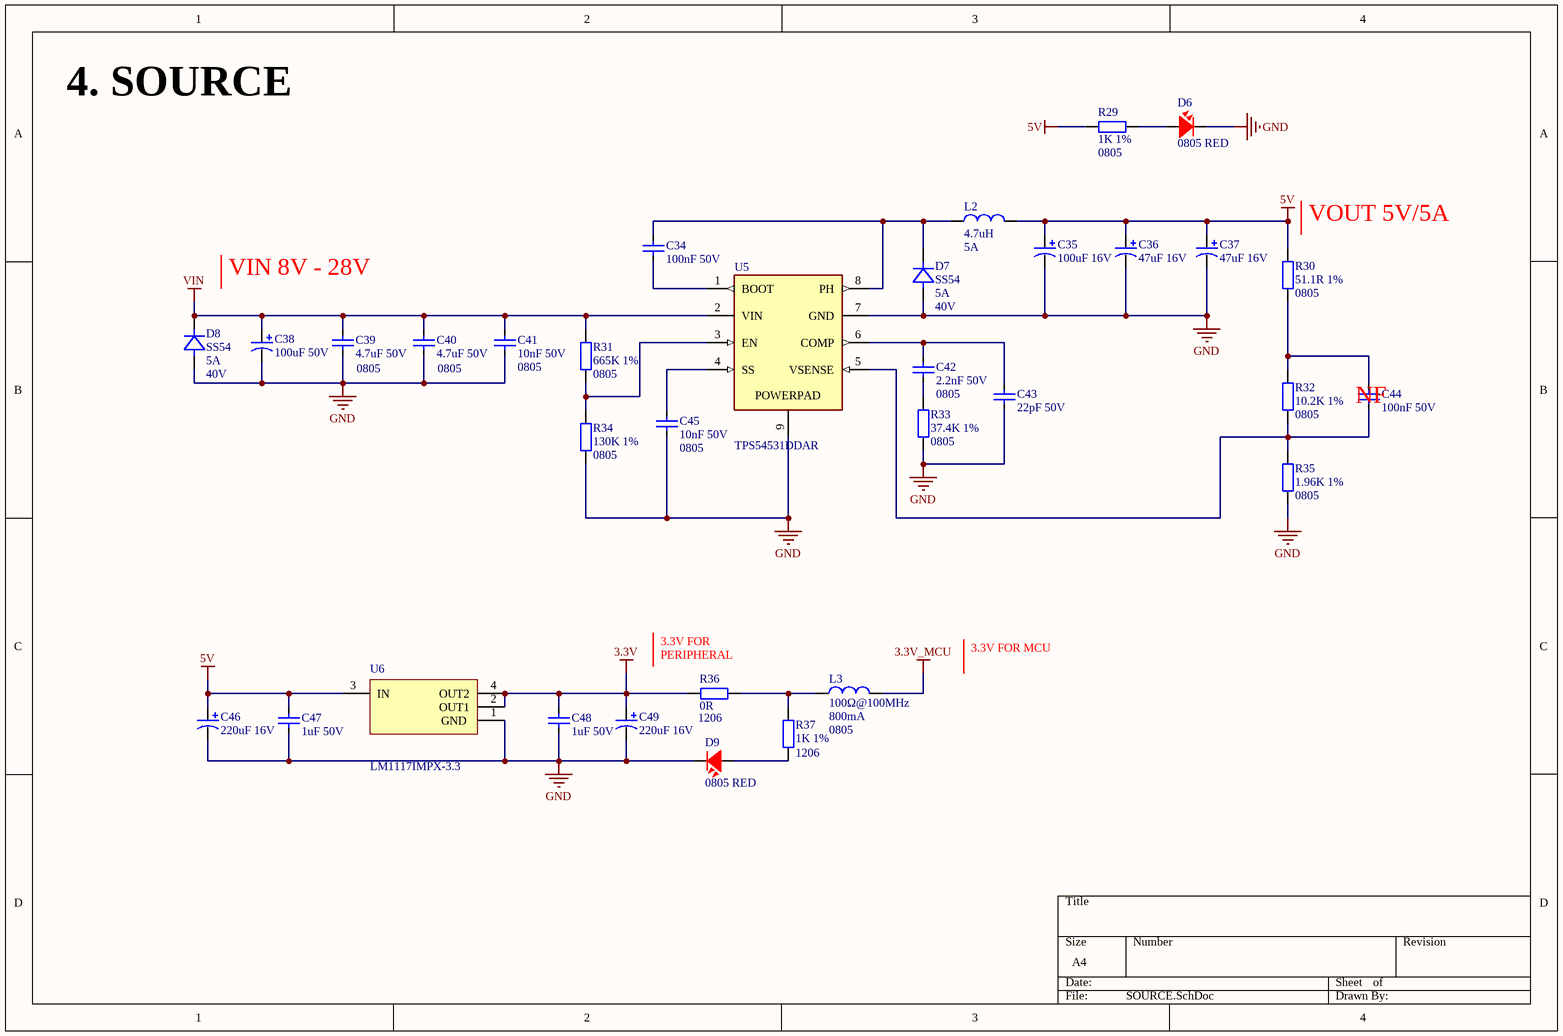
[diagram p3: SOURCE.SchDoc]

### Parts
C34  100nF 50V  [CAP_SMD_0805]
C35  100uF 16V  [CAP-ALU-SMD-D]
C36  47uF 16V  [CAP-ALU-SMD-C]
C37  47uF 16V  [CAP-ALU-SMD-C]
C38  100uF 50V  [CAP-ALU-SMD-F]
C39  4.7uF 50V  Size: 0805  [CAP_SMD_0805]
C40  4.7uF 50V  Size: 0805  [CAP_SMD_0805]
C41  10nF 50V  Size: 0805  [CAP_SMD_0805]
C42  2.2nF 50V  Size: 0805  [CAP_SMD_0805]
C43  22pF 50V  [CAP_SMD_0805]
C44  100nF 50V  [CAP_SMD_0805]
C45  10nF 50V  Size: 0805  [CAP_SMD_0805]
C46  220uF 16V  [CAP-ALU-SMD-D]
C47  1uF 50V  [CAP_SMD_0805]
C48  1uF 50V  [CAP_SMD_0805]
C49  220uF 16V  [CAP-ALU-SMD-D]
D6  0805 RED  [LED-0805-Red]
D7  SS54  Current: 5A  DC Voltage: 40V  [SMA]
D8  SS54  Current: 5A  DC Voltage: 40V  [SMA]
D9  0805 RED  [LED-0805-Red]
L2  Inductor: 4.7uH  Current: 5A  [L0630]  (hidden comment: 4.7uH 5A)
L3  Impedance @ Frequency: 100Ω@100MHz  Current: 800mA  Size: 0805  [FB_0805]  (hidden comment: 100Ohms 100Mhz)
R29  1K 1%  Size: 0805  [RES_SMD_0805]
R30  51.1R 1%  Size: 0805  [RES_SMD_0805]
R31  665K 1%  Size: 0805  [RES_SMD_0805]
R32  10.2K 1%  Size: 0805  [RES_SMD_0805]
R33  37.4K 1%  Size: 0805  [RES_SMD_0805]
R34  130K 1%  Size: 0805  [RES_SMD_0805]
R35  1.96K 1%  Size: 0805  [RES_SMD_0805]
R36  0R  Size: 1206  [RES_SMD_1206]
R37  1K 1%  Size: 1206  [RES_SMD_1206]
U5  TPS54531DDAR  [TPS54531DDAR]
U6  LM1117IMPX-3.3  [SOT-223-4]

### Nets
3.3V: C48.2 C49.1 R36.1 U6.2(OUT1) U6.4(OUT2)
3.3V_MCU: L3.2
5V: C35.1 C36.1 C37.1 C46.1 C47.2 L2.2 R29.1 R30.2 U6.3(IN)
GND: C35.2 C36.2 C37.2 C38.2 C39.1 C40.1 C41.1 C43.1 C45.1 C46.2 C47.1 C48.1 C49.2 D6.2 D7.A D8.A D9.2 R33.1 R34.1 R35.1 U5.7(GND) U5.9(POWERPAD) U6.1(GND)
VIN: C38.1 C39.2 C40.2 C41.2 D8.C R31.2 U5.2(VIN)
NetC34_1: C34.1 U5.1(BOOT)
NetC34_2: C34.2 D7.C L2.1 U5.8(PH)
NetC42_1: C42.1 R33.2
NetC42_2: C42.2 C43.2 U5.6(COMP)
NetC44_1: C44.1 R32.1 R35.2 U5.5(VSENSE)
NetC44_2: C44.2 R30.1 R32.2
NetC45_2: C45.2 U5.4(SS)
NetD6_1: D6.1 R29.2
NetD9_1: D9.1 R37.1
NetL3_1: L3.1 R36.2 R37.2
NetR31_1: R31.1 R34.2 U5.3(EN)

### Notes on the sheet
- 4. SOURCE
- (near R30) VOUT 5V/5A
- VIN 8V - 28V
- (near C44) NF
- (near R36) 3.3V FOR PERIPHERAL
- 3.3V FOR MCU
- (in symbol LM1117IMPX-3.3/NOPB) /

### Library data of the parts
C34 C44 = C0805_MLCC_100nF_50V: as C58 on sheet MCU; Packaging: Cut Tape (CT); Link: https://www.digikey.cn/en/products/detail/yageo/CC0805KRX7R9BB104/302874; Price: $0.10; Size: 0805
C35 = C_ALU_100uF_16V: as C54 on sheet MCU; Link: https://www.lcsc.com/product-detail/Aluminum-Electrolytic-Capacitors-SMD_DMBJ-RVT1C101M0605-100UF-16V_C970684.html; Price: $1.37
C36 C37 = C_ALU_47uF_16V: 47uF 16V 33mA@120Hz ±20% SMD,D5xL5.4mm Aluminum Electrolytic Capacitors - SMD ROHS; Manufacturer: DMBJ; Manufacture Part Number: RVT1C470M0505 47UF 16V; Link: https://www.lcsc.com/product-detail/Aluminum-Electrolytic-Capacitors-SMD_DMBJ-RVT1C470M0505-47UF-16V_C970676.html; Price: $ 0.0316
C38 = C_ALU_100uF_50V: 100uF 50V 140mA@120Hz ±20% SMD,D8xL10mm Aluminum Electrolytic Capacitors - SMD ROHS; Manufacturer: Nichicon; Manufacture Part Number: UWT1H101MNL1GS; Link: https://jlcpcb.com/partdetail/Nichicon-UWT1H101MNL1GS/C445063?spm=searchList; Price: $0.1311
C39 C40 = C0805_MLCC_4.7uF_50V: as C16 on sheet ETHERNET; Packaging: Cut Tape (CT); Link: https://www.digikey.cn/en/products/detail/samsung-electro-mechanics/CL21A475KBQNNNE/3886906; Price: $0.23
C41 C45 = C0805_MLCC_10nF_50V: as C15 on sheet ETHERNET; Packaging: Cut Tape (CT); Link: https://www.digikey.cn/en/products/detail/samsung-electro-mechanics/CL21B103KBANNNC/3886673; Price: $0.10
C42 = C0805_MLCC_2.2nF_50V: 2200 pF ±1% 50V Ceramic Capacitor C0G, NP0 0805 (2012 Metric); Manufacturer: YAGEO; Manufacture Part Number: CC0805FKNPO9BN222; Packaging: Cut Tape (CT); Link: https://www.digikey.cn/en/products/detail/yageo/CC0805FKNPO9BN222/5883918; Price: $0.45
C43 = C0805_MLCC_22pF_50V: as C67 on sheet MCU; Packaging: Cut Tape (CT); Link: https://www.digikey.cn/en/products/detail/kyocera-avx/600F220FT250XT/3905100; Price: $2.26; Size: 0805
C46 C49 = C_ALU_220uF_16V: 16V 220uF ±20% SMD,6.3x7.7mm Solid Capacitors ROHS; Manufacturer: Lelon; Manufacture Part Number: OVZ221M1CTR-0608ACS; Link: https://jlcpcb.com/partdetail/Lelon-OVZ221M1CTR0608ACS/C881921; Price: $0.1949
C47 C48 = C0805_MLCC_1uF_50V: as C50 on sheet MCU; Packaging: Cut Tape (CT); Link: https://www.digikey.cn/en/products/detail/samsung-electro-mechanics/CL21B105KBFNNNG/3894467; Price: $0.11; Size: 0805
D6 D9 = LED_0805_RED: Red 625nm LED Indication - Discrete 2V 0805 (2012 Metric); Manufacturer: Würth Elektronik; Manufacture Part Number: 150080RS75000; Packaging: Cut Tape (CT); Link: https://www.digikey.cn/en/products/detail/w%C3%BCrth-elektronik/150080RS75000/4489918; Price: $0.19
D7 D8 = SS54: DIODE SCHOTTKY 40V 5A SMA; Manufacturer: EVVO; Manufacture Part Number: SS54; Packaging: Cut Tape (CT); Link: https://www.digikey.cn/en/products/detail/evvo/SS54/21407219; Price: $0.73
L2 = L0630_4.7uH _5A: 4.7 µH Shielded Molded Inductor 3.2 A 81.3mOhm Max Nonstandard; Manufacturer: SHOU HAN; Manufacture Part Number: CYA0630-4.7UH; Packaging: Cut Tape (CT); Link: https://www.lcsc.com/product-detail/Inductors-SMD_SHOU-HAN-CYA0630-4-7UH_C5189748.html; Price: $ 0.1112
L3 = FR_100Ohms_100Mhz: as L1 on sheet ETHERNET; Link: https://jlcpcb.com/partdetail/taitech-FCM2012KF101T08/C304250; Price: $0.0064
R29 = R0805_1K: as R18 on sheet RS485_RS232; Packaging: Cut Tape (CT); Link: https://www.digikey.com/en/products/detail/yageo/RC0805FR-071KL/727444; Price: $0.10
R30 = R0805_51.1R: 51.1 Ohms ±1% 0.125W, 1/8W Chip Resistor 0805 (2012 Metric) Moisture Resistant Thick Film; Manufacturer: YAGEO; Manufacture Part Number: RC0805FR-0751R1L; Packaging: Cut Tape (CT); Link: https://www.digikey.cn/en/products/detail/yageo/RC0805FR-0751R1L/728014; Price: $0.10
R31 = R0805_665K: 665 kOhms ±1% 0.125W, 1/8W Chip Resistor 0805 (2012 Metric) Moisture Resistant Thick Film; Manufacturer: YAGEO; Manufacture Part Number: RC0805FR-07665KL; Packaging: Cut Tape (CT); Link: https://www.digikey.cn/en/products/detail/yageo/RC0805FR-07665KL/728096; Price: $0.10
R32 = R0805_10.2K: 10.2 kOhms ±1% 0.125W, 1/8W Chip Resistor 0805 (2012 Metric) Moisture Resistant Thick Film; Manufacturer: YAGEO; Manufacture Part Number: RC0805FR-0710K2L; Packaging: Cut Tape (CT); Link: https://www.digikey.cn/en/products/detail/yageo/RC0805FR-0710K2L/727538; Price: $0.10
R33 = R0805_37.4K: 37.4 kOhms ±1% 0.125W, 1/8W Chip Resistor 0805 (2012 Metric) Moisture Resistant Thick Film; Manufacturer: YAGEO; Manufacture Part Number: RC0805FR-0737K4L; Packaging: Cut Tape (CT); Link: https://www.digikey.cn/en/products/detail/yageo/RC0805FR-0737K4L/727891; Price: $0.10
R34 = R0805_130K: 130 kOhms ±1% 0.125W, 1/8W Chip Resistor 0805 (2012 Metric) Moisture Resistant Thick Film; Manufacturer: YAGEO; Manufacture Part Number: RC0805FR-07130KL; Packaging: Cut Tape (CT); Link: https://www.digikey.cn/en/products/detail/yageo/RC0805FR-07130KL/727590; Price: $0.10
R35 = R0805_1.96K: 1.96 kOhms ±1% 0.125W, 1/8W Chip Resistor 0805 (2012 Metric) Moisture Resistant Thick Film; Manufacturer: YAGEO; Manufacture Part Number: RC0805FR-071K96L; Packaging: Cut Tape (CT); Link: https://www.digikey.cn/en/products/detail/yageo/RC0805FR-071K96L/727532; Price: $0.10
R36 = R1206_0R: 0 Ohms Jumper Chip Resistor 1206 (3216 Metric) Moisture Resistant Thick Film; Manufacturer: YAGEO; Manufacture Part Number: RC1206JR-070RL; Packaging: Cut Tape (CT); Link: https://www.digikey.cn/en/products/detail/yageo/RC1206JR-070RL/729184; Price: $0.18
R37 = R1206_1K: 1 kOhms ±1% 0.5W, 1/2W Chip Resistor 1206 (3216 Metric) Anti-Sulfur Thin Film; Manufacturer: Stackpole Electronics Inc; Manufacture Part Number: RNCP1206FTD1K00; Packaging: Cut Tape (CT); Link: https://www.digikey.cn/en/products/detail/stackpole-electronics-inc/RNCP1206FTD1K00/2240337; Price: $0.18
U5 = TPS54531DDAR: Buck Switching Regulator IC Positive Adjustable 0.8V 1 Output 5A 8-PowerSOIC (0.154", 3.90mm Width); Manufacturer: Texas Instruments; Manufacture Part Number: TPS54531DDAR; Packaging: Cut Tape; Link: https://www.digikey.cn/en/products/detail/texas-instruments/TPS54531DDAR/4162425; Price: $1.79
U6 = LM1117IMPX-3.3/NOPB: Linear Voltage Regulator IC Positive Fixed 1 Output 800mA SOT-223-4; Manufacturer: Texas Instruments; Manufacture Part Number: LM1117IMPX-3.3/NOPB; Packaging: Cut Tape (CT); Link: https://www.digikey.cn/en/products/detail/texas-instruments/LM1117IMPX-3-3-NOPB/1870906; Price: $1.14

## Sheet PERIPHERALS.SchDoc
size A4; SheetNumber: 5; SheetTotal: 5

## Nets that join several sheets
3.3V: RS485_RS232 (JP3.10 JP3.12 U1.2), ETHERNET (6 pins), SOURCE (5 pins)
3.3V_MCU: MCU (28 pins), SOURCE (L3.2)
5V: RS485_RS232 (17 pins), SOURCE (9 pins)
GND: MCU (30 pins), RS485_RS232 (30 pins), ETHERNET (28 pins), SOURCE (23 pins)
INTn_MCU: MCU (U7.32), ETHERNET (U3.36)
LED1: MCU (U7.46), RS485_RS232 (R25.2)
LED2: MCU (U7.25), RS485_RS232 (R26.2)
MISO_MCU: MCU (U7.16), ETHERNET (U3.34)
MOSI_MCU: MCU (U7.17), ETHERNET (U3.35)
OE_MCU: MCU (U7.2), RS485_RS232 (R24.2 U1.10)
RS232_RX_MCU: MCU (U7.13), RS485_RS232 (U1.6)
RS232_TX_MCU: MCU (U7.12), RS485_RS232 (U1.5)
RS458_DIR_MCU: MCU (U7.29), RS485_RS232 (U1.3)
RS458_RX_MCU: MCU (U7.31), RS485_RS232 (U1.1)
RS458_TX_MCU: MCU (U7.30), RS485_RS232 (U1.4)
RSTn_MCU: MCU (U7.33), ETHERNET (U3.37)
SCLK_MCU: MCU (U7.15), ETHERNET (U3.33)
SCSn_MCU: MCU (U7.14), ETHERNET (U3.32)